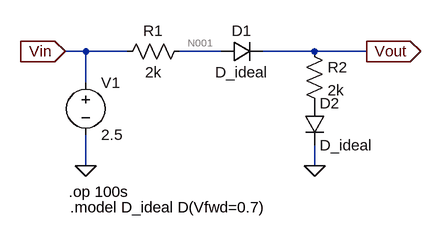
[diagram p0: schematic Prob_2a.asc]
Prob_2a.asc, the LTspice schematic file:
Version 4
SHEET 1 880 680
WIRE 64 64 32 64
WIRE 128 64 64 64
WIRE 272 64 208 64
WIRE 416 64 336 64
WIRE 496 64 416 64
WIRE 64 112 64 64
WIRE 64 240 64 192
WIRE 416 240 416 208
FLAG 64 240 0
FLAG 416 240 0
FLAG 32 64 Vin
IOPIN 32 64 In
FLAG 496 64 Vout
IOPIN 496 64 Out
SYMBOL voltage 64 96 R0
WINDOW 123 0 0 Left 0
WINDOW 39 0 0 Left 0
SYMATTR InstName V1
SYMATTR Value 2.5
SYMBOL res 224 48 R90
WINDOW 0 0 56 VBottom 2
WINDOW 3 32 56 VTop 2
SYMATTR InstName R1
SYMATTR Value 2k
SYMBOL diode 272 80 R270
WINDOW 0 32 32 VTop 2
WINDOW 3 0 32 VBottom 2
SYMATTR InstName D1
SYMATTR Value D_ideal
SYMBOL res 400 48 R0
SYMATTR InstName R2
SYMATTR Value 2k
SYMBOL diode 400 144 R0
SYMATTR InstName D2
SYMATTR Value D_ideal
TEXT 38 280 Left 2 !.op 100s
TEXT 40 304 Left 2 !.model D_ideal D(Vfwd=0.7)

The netlist it stands for:
* Prob_2a.asc
V1 Vin 0 2.5
R1 N001 Vin 2k
D1 N001 Vout D_ideal
R2 Vout P001 2k
D2 P001 0 D_ideal
.model D D
.lib standard.dio
.op 100s
.model D_ideal D(Vfwd=0.7)
.backanno
.end

* Results of the author's LTspice run, read from the files saved beside the schematic
* Operating Point:
*   V(vin) = 2.5 V
*   V(n001) = 1.95 V
*   V(vout) = 1.25 V
*   V(p001) = 700 mV
*   I(D2) = 275 µA
*   I(D1) = 275 µA
*   I(R2) = 275 µA
*   I(R1) = -275 µA
*   I(V1) = -275 µA
* From the log:
*   Semiconductor Device Operating Points:
*                           --- Diodes ---
*   Name:      d2          d1
*   Model:   d_ideal     d_ideal
*   Id:      2.75e-04    2.75e-04
*   Vd:      7.00e-01    7.00e-01
*   Req:     1.00e+03    1.00e+03
*   CAP:     0.00e+00    0.00e+00